# Altium schematic sheet Mikrolysreklamen15.SchDoc
size A3
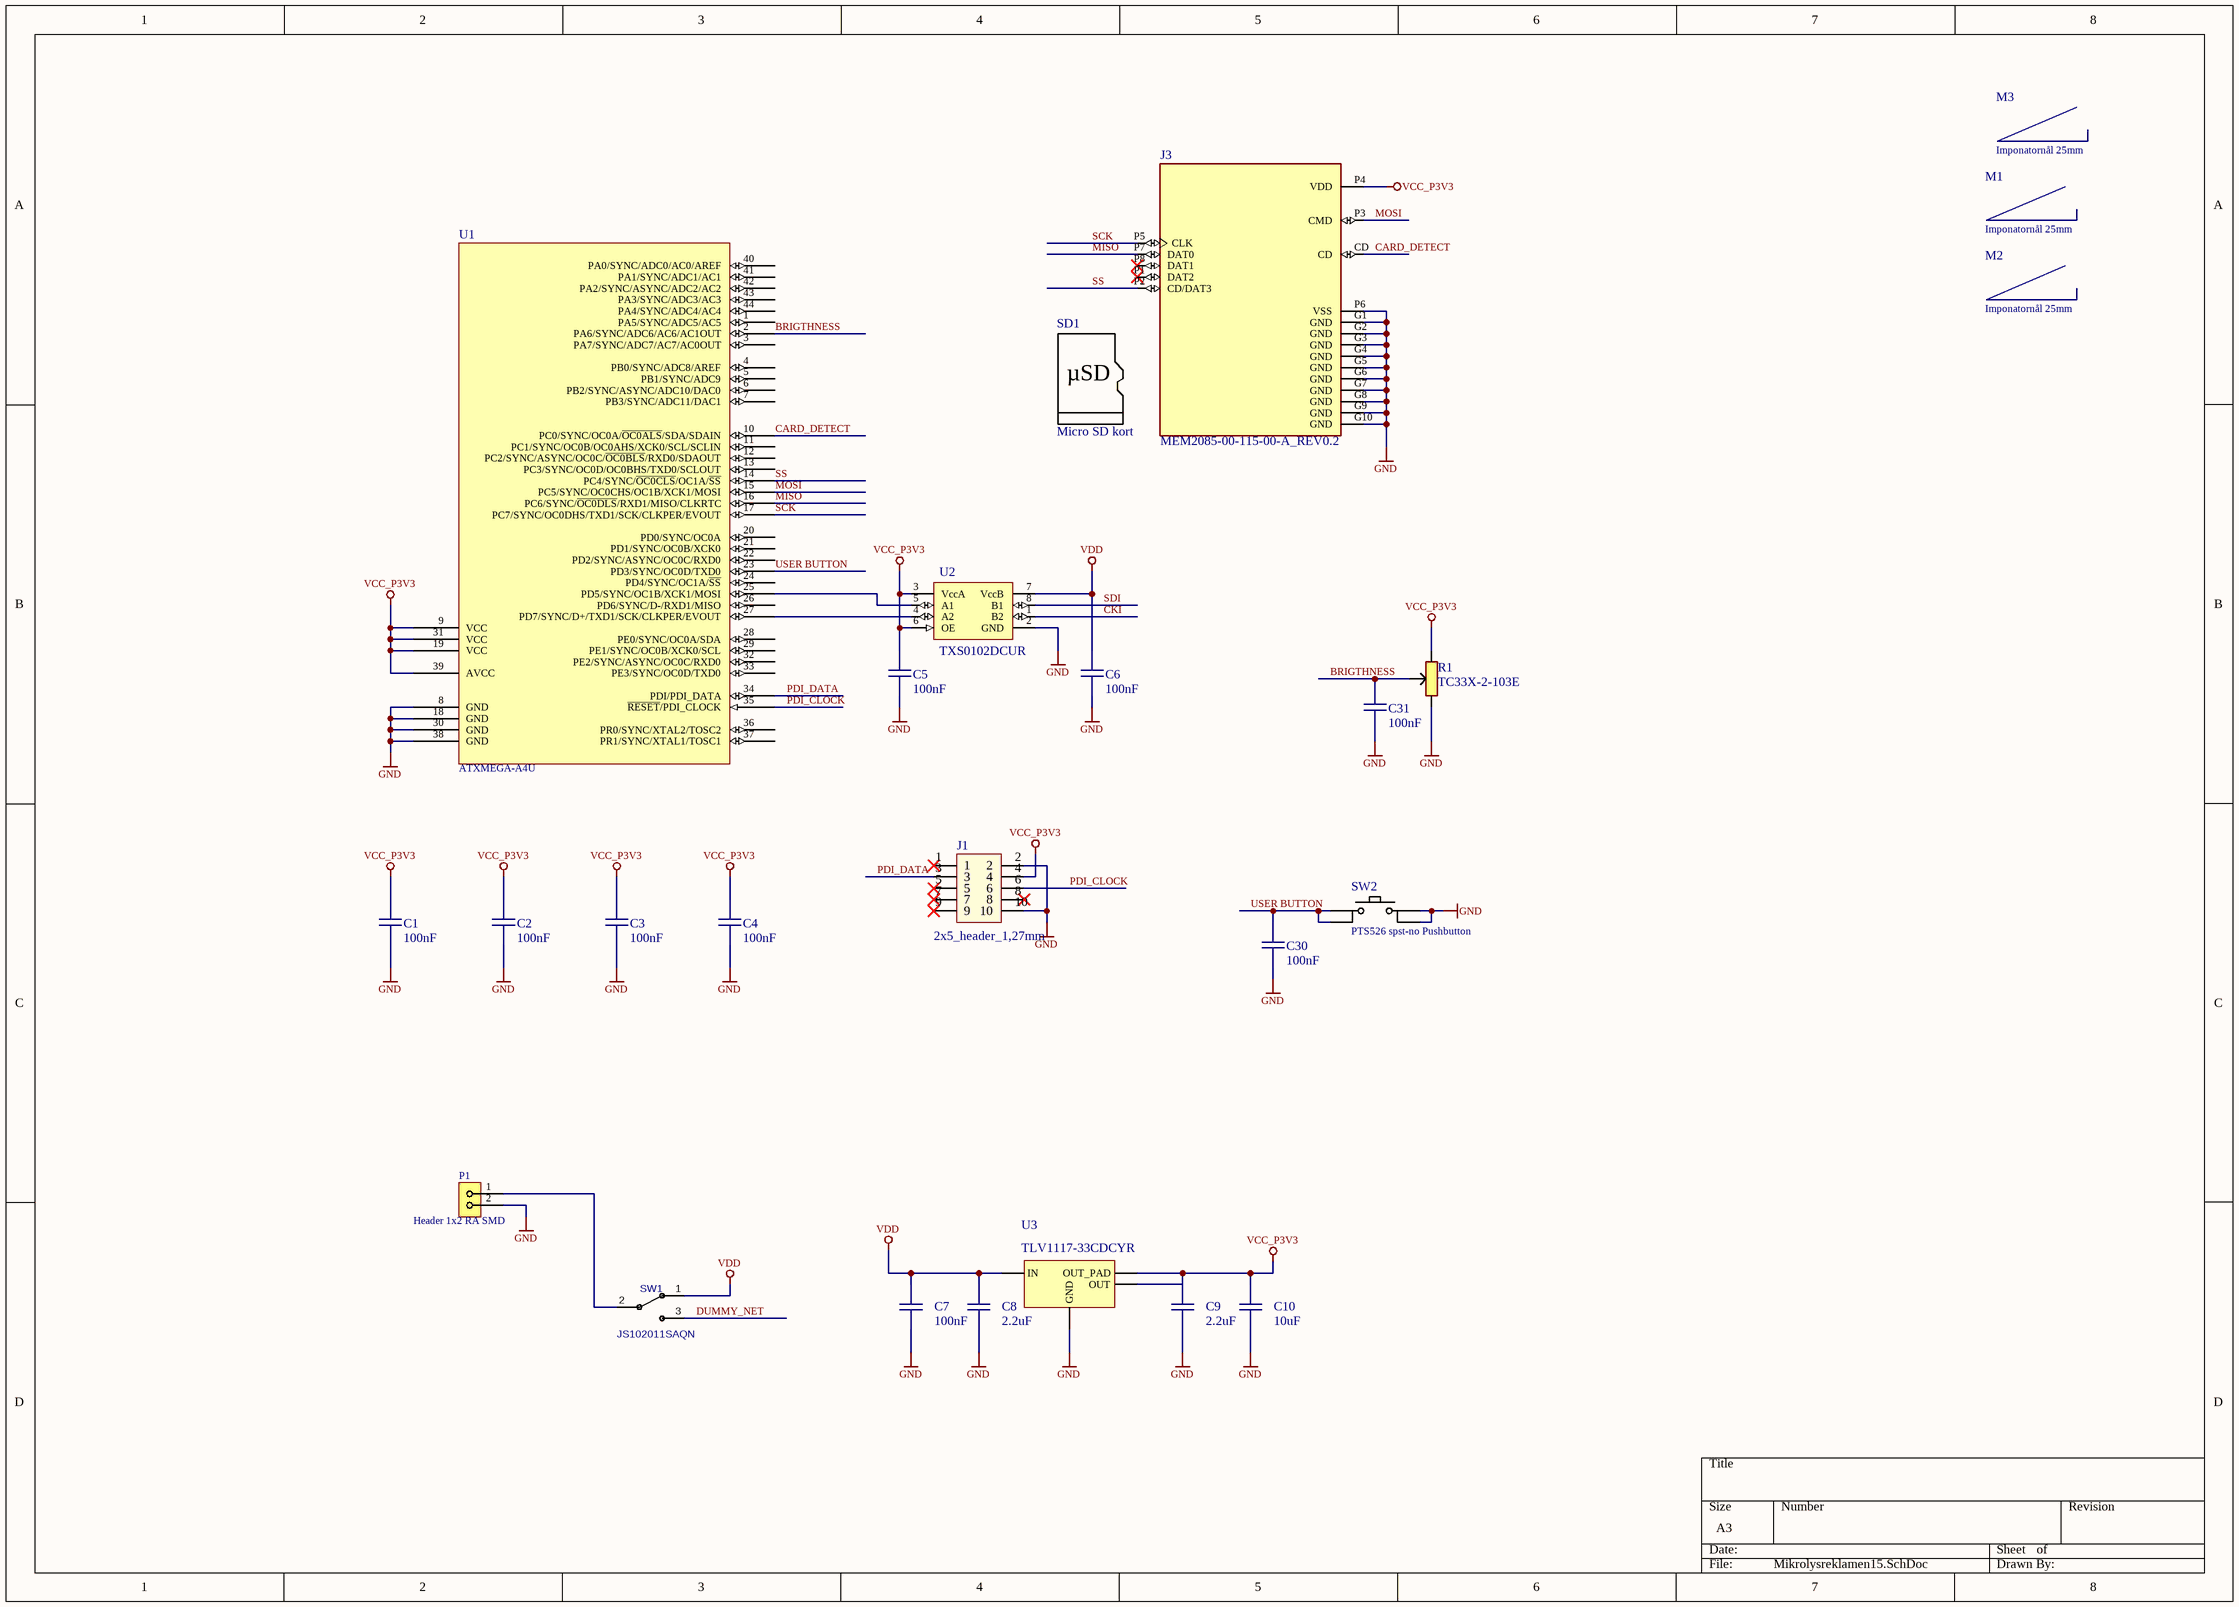
[diagram p0: Mikrolysreklamen15.SchDoc]

## Parts
C1  100nF  [CAPC0603(1608)55_N]
C2  100nF  [CAPC0603(1608)55_N]
C3  100nF  [CAPC0603(1608)55_N]
C4  100nF  [CAPC0603(1608)55_N]
C5  100nF  [CAPC0603(1608)55_N]
C6  100nF  [CAPC0603(1608)55_N]
C7  100nF  [CAPC0603(1608)55_N]
C8  2.2uF  [CAPC0603(1608)55_N]
C9  2.2uF  [CAPC0603(1608)55_N]
C10  10uF  [CAPC0805(2012)100_N]
C30  100nF  [CAPC0603(1608)55_N]
C31  100nF  [CAPC0603(1608)55_N]
J1  2x5_header_1,27mm  [SMDHDRV10P127_2X5_615X330X560B]
J3  MEM2085-00-115-00-A_REV0.2  [GCT_MEM2085-00-115-00-A_REV0.2]
M1  Imponatornål 25mm  [Imponatornaal_liten]
M2  Imponatornål 25mm  [Imponatornaal_liten]
M3  Imponatornål 25mm  [Imponatornaal_liten]
P1  Header 1x2 RA SMD
R1  TC33X-2-103E  [TRIM_TC33X-2-103E]
SD1  Micro SD kort  [microsdcard]
SW1  JS102011SAQN
SW2  PTS526 spst-no Pushbutton  [PTS526_SK15_SMTR2_LFS]
U1  ATXMEGA-A4U  [TQFP80P1200X1200X120-44N]
U2  TXS0102DCUR
U3  TLV1117-33CDCYR  [SOT230P700X180-4N]

## Nets
GND: C1.1 C2.1 C3.1 C4.1 C5.1 C6.1 C7.1 C8.1 C9.1 C10.1 C30.1 C31.1 J1.2 J1.10 J3.G1(GND) J3.G2(GND) J3.G3(GND) J3.G4(GND) J3.G5(GND) J3.G6(GND) J3.G7(GND) J3.G8(GND) J3.G9(GND) J3.G10(GND) J3.P6(VSS) P1.2 R1.1 SW2.3 SW2.4 U1.8(GND) U1.18(GND) U1.30(GND) U1.38(GND) U2.2(GND) U3.1(GND)
VCC_P3V3: C1.2 C2.2 C3.2 C4.2 C5.2 C9.2 C10.2 J1.4 J3.P4(VDD) R1.3 U1.9(VCC) U1.19(VCC) U1.31(VCC) U1.39(AVCC) U2.3(VccA) U2.6(OE) U3.2(OUT_PAD) U3.4(OUT)
VDD: C6.2 C7.2 C8.2 SW1.1 U2.7(VccB) U3.3(IN)
BRIGTHNESS: C31.2 R1.2 U1.2(PA6/SYNC/ADC6/AC6/AC1OUT)
CARD_DETECT: J3.CD U1.10(PC0/SYNC/OC0A/~{OC0ALS}/SDA/SDAIN)
CKI: U2.1(B2)
DUMMY_NET: SW1.3
MISO: J3.P7(DAT0) U1.16(PC6/SYNC/~{OC0DLS}/RXD1/MISO/CLKRTC)
MOSI: J3.P3(CMD) U1.15(PC5/SYNC/OC0CHS/OC1B/XCK1/MOSI)
PDI_CLOCK: J1.6 U1.35(~{RESET}/PDI_CLOCK)
PDI_DATA: J1.3 U1.34(PDI/PDI_DATA)
SCK: J3.P5(CLK) U1.17(PC7/SYNC/OC0DHS/TXD1/SCK/CLKPER/EVOUT)
SDI: U2.8(B1)
SS: J3.P2(CD/DAT3) U1.14(PC4/SYNC/~{OC0CLS}/OC1A/~{SS})
USER BUTTON: C30.2 SW2.1 SW2.2 U1.23(PD3/SYNC/OC0D/TXD0)
NetP1_1: P1.1 SW1.2
NetU1_25: U1.25(PD5/SYNC/OC1B/XCK1/MOSI) U2.5(A1)
NetU1_27: U1.27(PD7/SYNC/D+/TXD1/SCK/CLKPER/EVOUT) U2.4(A2)

Not connected (* = marked no-connect by the designer): J1 1* 5* 7* 8* 9*; J3 P1(DAT2)* P8(DAT1)*; M1 0; M2 0; M3 0; U1 1(PA5/SYNC/ADC5/AC5) 3(PA7/SYNC/ADC7/AC7/AC0OUT) 4(PB0/SYNC/ADC8/AREF) 5(PB1/SYNC/ADC9) 6(PB2/SYNC/ASYNC/ADC10/DAC0) 7(PB3/SYNC/ADC11/DAC1) 11(PC1/SYNC/OC0B/OC0AHS/XCK0/SCL/SCLIN) 12(PC2/SYNC/ASYNC/OC0C/~{OC0BLS}/RXD0/SDAOUT) 13(PC3/SYNC/OC0D/OC0BHS/TXD0/SCLOUT) 20(PD0/SYNC/OC0A) 21(PD1/SYNC/OC0B/XCK0) 22(PD2/SYNC/ASYNC/OC0C/RXD0) 24(PD4/SYNC/OC1A/~{SS}) 26(PD6/SYNC/D-/RXD1/MISO) 28(PE0/SYNC/OC0A/SDA) 29(PE1/SYNC/OC0B/XCK0/SCL) 32(PE2/SYNC/ASYNC/OC0C/RXD0) 33(PE3/SYNC/OC0D/TXD0) 36(PR0/SYNC/XTAL2/TOSC2) 37(PR1/SYNC/XTAL1/TOSC1) 40(PA0/SYNC/ADC0/AC0/AREF) 41(PA1/SYNC/ADC1/AC1) 42(PA2/SYNC/ASYNC/ADC2/AC2) 43(PA3/SYNC/ADC3/AC3) 44(PA4/SYNC/ADC4/AC4)

## Notes on the sheet
- (in symbol 3019) µSD

## Library data of the parts
C1-C6 C30 C31 = 5152: pakke_opprettet_av: 815; leverandor_varenr: 1759122; pris: 1; nokkelord: Kondensator, Capacitor, CAP; pakketype: 0603; produsent: Multicomp; leverandor: Farnell; id: 5152; rad: 21; rom: OV; lager_type: Baklager; dybde: 0; antall: 985; beskrivelse: X7R 50V 5%; komponenttype: 2; navn: 100nF; pakke_opprettet: 18/02/2015 14:18:13; symbol_opprettet_av: 815; symbol_opprettet: 14/11/2014 20:19:34; hylle: 0; elektrisk_verdi: 100nF
C7 = 5152: id: 5152; rad: 21; rom: OV; lager_type: Baklager; dybde: 0; antall: 985; pakke_opprettet_av: 815; beskrivelse: X7R 50V 5%; leverandor_varenr: 1759122; pris: 1; nokkelord: Kondensator, Capacitor, CAP; produsent: Multicomp; leverandor: Farnell; pakketype: 0603; komponenttype: 2; hylle: 0; pakke_opprettet: 18/02/2015 14:18:13; symbol_opprettet_av: 815; symbol_opprettet: 14/11/2014 20:19:34; navn: 100nF; elektrisk_verdi: 100nF
C8 C9 = 5166: id: 5166; pakke_opprettet_av: 815; beskrivelse: X7R 6.3V; leverandor_varenr: 2320810; pris: 1; nokkelord: Kondensator, capacitor; produsent: Multicomp; leverandor: Farnell; pakketype: 0603; komponenttype: 2; pakke_opprettet: 18/02/2015 14:18:13; symbol_opprettet_av: 815; symbol_opprettet: 14/11/2014 20:19:34; navn: 2.2uF; elektrisk_verdi: 2.2uF
C10 = 3275: id: 3275; rad: 1; rom: OV; lager_type: Fremlager; dybde: 0; hylle: 6; antall: 60; pakke_opprettet_av: 815; beskrivelse: SMD, 6.3V ± 10% X5R; leverandor_varenr: 2320852; nokkelord: Kondensator, Capacitor, CAP; produsent: Multicomp; leverandor: Farnell; pakketype: 0805; komponenttype: 2; pakke_opprettet: 14/11/2014 20:52:01; symbol_opprettet_av: 815; symbol_opprettet: 14/11/2014 20:19:34; navn: 10uF; pris: 1; elektrisk_verdi: 10uF
J1 = 4343: id: 4343; pakke_opprettet_av: 815; symbol_opprettet_av: 1366; navn: Header SMD 127 2x5; pris: 20; nokkelord: JTAG; pakketype: SMD; rad: 4; rom: OV; lager_type: Fremlager; dybde: 0; hylle: 6; antall: 53; beskrivelse: 1,27mm Pitch SMD Header; leverandor_varenr: 2886068; leverandor: Farnell; komponenttype: 11; pakke_opprettet: 15/11/2014 18:30:38; symbol_opprettet: 11/03/2019 22:06:02
J3 = 6893: MicroSD Push pull Memory Card Connector; MF: Global Connector Technology; id: 6893; pakke_opprettet_av: 815; beskrivelse: MICRO SD PUSH-PULL SMT 1.15MM; leverandor_varenr: 2073-MEM2085-00-115-00-ACT-ND; navn: MEM2085 microSDcardHolder; pris: 12; nokkelord: sdcard, microsd; produsent: GCT; leverandor: DigiKey; pakketype: SMD; komponenttype: 11; Package: None; Availability: Not in stock; SnapEDA_Link: https://www.snapeda.com/parts/MEM2085-00-115-00-A/Global+Connector+Technology/view-part/?ref=snap; MP: MEM2085-00-115-00-A; Price: None; Value: *; Check_prices: https://www.snapeda.com/parts/MEM2085-00-115-00-A/Global+Connector+Technology/view-part/?ref=eda; pakke_opprettet: 16/04/2023 02:33:45; symbol_opprettet_av: 815; symbol_opprettet: 16/04/2023 02:35:20; produsent_varenr: MEM2085-00-115-00-A
M1-M3 = 4547: nål til imponatorplate 25mm (Brooch back); id: 4547; rad: 9; rom: OV; lager_type: Fremlager; dybde: 0; hylle: 3; antall: 78; pakke_opprettet_av: 815; leverandor_varenr: 600721; pris: 5; nokkelord: cchobby.no; produsent: Jewellery Maker; pakketype: SMD; pakke_opprettet: 15/11/2018 22:49:40; symbol_opprettet_av: 815; symbol_opprettet: 23/10/2015 21:10:45; navn: Imponatornål 25mm
P1 = 6937: id: 6937; symbol_opprettet_av: 815; beskrivelse: 2.54mm pitch Right Angle SMD mount header; leverandor_varenr: SAM10266-ND; pris: 0; nokkelord: header pin connector angle vinkel flat; produsent: SAMTEC; produsent_varenr: TSM-102-01-L-SH-A; leverandor: DigiKey; komponenttype: 11; symbol_opprettet: 13/11/2014 10:58:53; navn: Header 1x2 RA SMD; pakketype: SMD
R1 = 6892: id: 6892; pakke_opprettet_av: 815; beskrivelse: SMD Trimpot; leverandor_varenr: TC33X-103ECT-ND; pris: 4; nokkelord: potentiometer, potmeter, trim, resistor; produsent: Bourns; elektrisk_verdi: 10k; leverandor: DigiKey; pakketype: SMD; komponenttype: 1; pakke_opprettet: 16/04/2023 02:23:24; symbol_opprettet_av: 815; symbol_opprettet: 03/11/2016 15:34:07; navn: TC33X-2-103E; produsent_varenr: TC33X-2-103E
SD1 = 3019: id: 3019; rad: 3; rom: OV; lager_type: Baklager; dybde: 1; antall: -1; pakke_opprettet_av: 815; pris: 70; nokkelord: SD, minnekort; hylle: 3; pakke_opprettet: 16/04/2023 02:41:18; symbol_opprettet_av: 815; symbol_opprettet: 16/04/2023 02:41:09; navn: Micro SD kort
SW1 = 6936: id: 6936; symbol_opprettet_av: 1150; beskrivelse: JS10 Series SPDT On-On 6V 0.3A Gull Wing SMT Slide Switch; leverandor_varenr: 401-1999-1-ND; pris: 0; nokkelord: Bryter; produsent: C&K; leverandor: DigiKey; pakketype: SMD; komponenttype: 12; symbol_opprettet: 03/11/2017 22:23:49; navn: JS102011SAQN; produsent_varenr: JS102011SAQN
SW2 = 6894: id: 6894; pakke_opprettet_av: 815; beskrivelse: Tactile SMD pushbutton 5.2x5.2mm 1.5mmh, 260gf, spst-no; leverandor_varenr: CKN12221-1-ND; pris: 2; nokkelord: knapp, button, tactile, spst-no; produsent: C&K; produsent_varenr: PTS526 SK15 SMTR2 LFS; leverandor: DigiKey; pakketype: SMD; komponenttype: 12; pakke_opprettet: 16/04/2023 03:26:55; symbol_opprettet_av: 815; symbol_opprettet: 14/11/2014 21:57:30; navn: PTS526 spst-no Pushbutton
U1 = 3992: id: 3992; rad: 4; rom: OV; lager_type: Fremlager; dybde: 0; hylle: 2; antall: 82; pakke_opprettet_av: 774; navn: ATXMEGA64A4U-AU; pakketype: TQFP; produsent: Atmel; beskrivelse: Mikrokontroller; komponenttype: 5; pakke_opprettet: 22/08/2014 14:00:28; symbol_opprettet_av: 774; symbol_opprettet: 22/08/2014 14:00:55; pris: 0
U2 = 6935: id: 6935; symbol_opprettet_av: 815; beskrivelse: Voltage Level Translator Bidirectional 1 circuit 2 channel; leverandor_varenr: 296-21931-1-ND; pris: 15; nokkelord: level shifter; produsent: Texas Instruments; leverandor: DigiKey; pakketype: TSSOP; symbol_opprettet: 02/05/2023 23:10:41; navn: TXS0102DCUR; produsent_varenr: TXS0102DCUR; komponenttype: 15
U3 = 4438: id: 4438; rad: 2; rom: OV; lager_type: Fremlager; dybde: 0; hylle: 5; antall: 151; pakke_opprettet_av: 774; beskrivelse: 3,3V Low dropout regulator; leverandor_varenr: 2447986; nokkelord: ldo; produsent: Texas Instruments; leverandor: Farnell; pakketype: SOT; komponenttype: 14; pakke_opprettet: 11/07/2014 22:00:23; symbol_opprettet_av: 774; symbol_opprettet: 11/07/2014 22:01:42; navn: TLV1117-33CDCYR; pris: 5